# Altium schematic sheet Sheet1.SchDoc
size A4; SheetNumber: 1; SheetTotal: 1
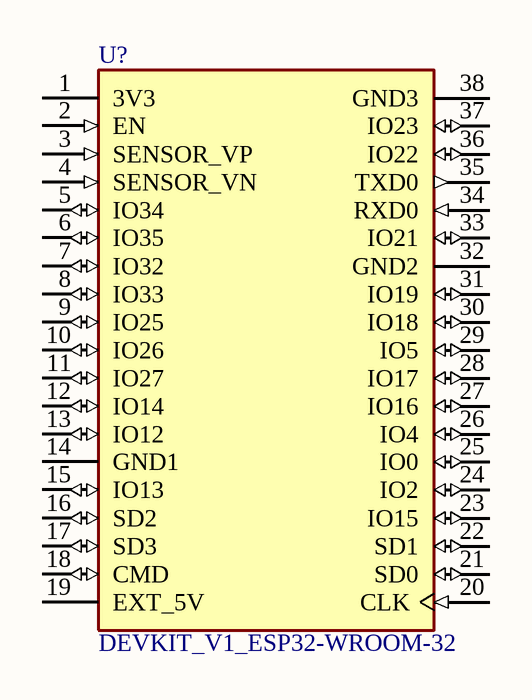
[diagram p0: Sheet1.SchDoc]

## Parts
U?  DEVKIT_V1_ESP32-WROOM-32  [MODULE_DEVKIT_V1_ESP32-WROOM-32]

## Nets

Not connected (* = marked no-connect by the designer): U? 1(3V3) 2(EN) 3(SENSOR_VP) 4(SENSOR_VN) 5(IO34) 6(IO35) 7(IO32) 8(IO33) 9(IO25) 10(IO26) 11(IO27) 12(IO14) 13(IO12) 14(GND1) 15(IO13) 16(SD2) 17(SD3) 18(CMD) 19(EXT_5V) 20(CLK) 21(SD0) 22(SD1) 23(IO15) 24(IO2) 25(IO0) 26(IO4) 27(IO16) 28(IO17) 29(IO5) 30(IO18) 31(IO19) 32(GND2) 33(IO21) 34(RXD0) 35(TXD0) 36(IO22) 37(IO23) 38(GND3)

## Library data of the parts
U? = DEVKIT_V1_ESP32-WROOM-32: WROOM-32 Development Board ESP32 ESP-32S WiFi Bluetooth Dev Module; MF: Espressif Systems; MP: DEVKIT V1 ESP32-WROOM-32; SnapEDA_Link: https://www.snapeda.com/parts/DEVKIT%20V1%20ESP32-WROOM-32/Espressif+Systems/view-part/?ref=snap; Package: Package; Value: *; Check_prices: https://www.snapeda.com/parts/DEVKIT%20V1%20ESP32-WROOM-32/Espressif+Systems/view-part/?ref=eda